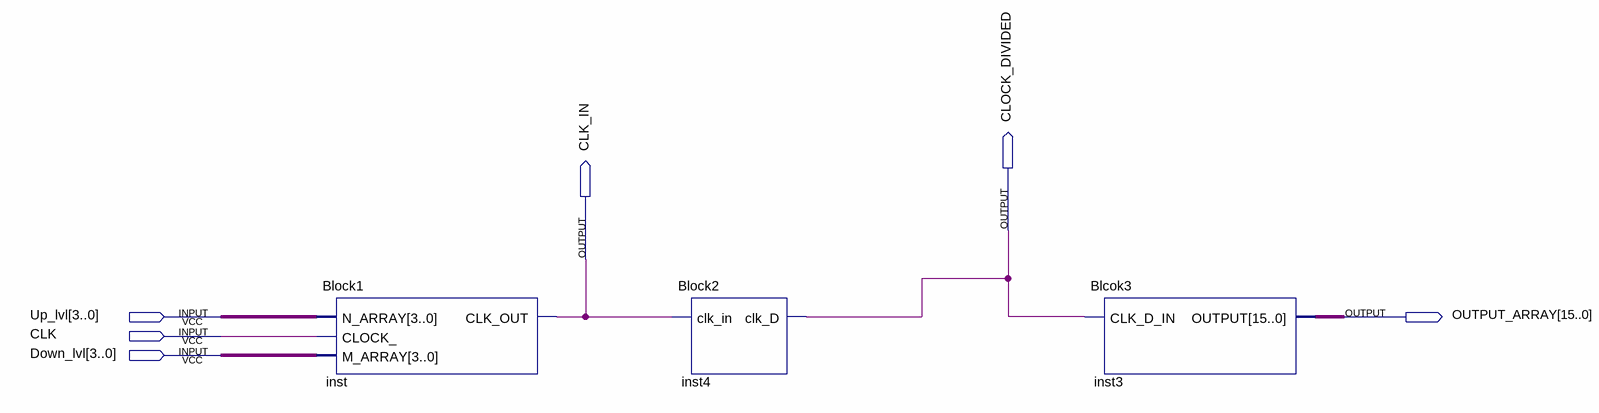
[diagram p0: schematic sheet]
// Quartus schematic main.bdf as structural Verilog: 3 symbols, 6 pins
module main (
  input  [3:0] Up_lvl,
  input  CLK,
  input  [3:0] Down_lvl,
  output CLOCK_DIVIDED,
  output CLK_IN,
  output [15:0] OUTPUT_ARRAY
);

  Block1 inst (.N_ARRAY(Up_lvl), .CLOCK_(CLK), .M_ARRAY(Down_lvl), .CLK_OUT(CLK_IN));
  Block2 inst4 (.clk_in(CLK_IN), .clk_D(CLOCK_DIVIDED));
  Blcok3 inst3 (.CLK_D_IN(CLOCK_DIVIDED), .OUTPUT(OUTPUT_ARRAY));
endmodule
